# EasyEDA Pro project ProProject_Access Control AC Power Switch_2024-06-07.epro, board V2.0.2 PCB
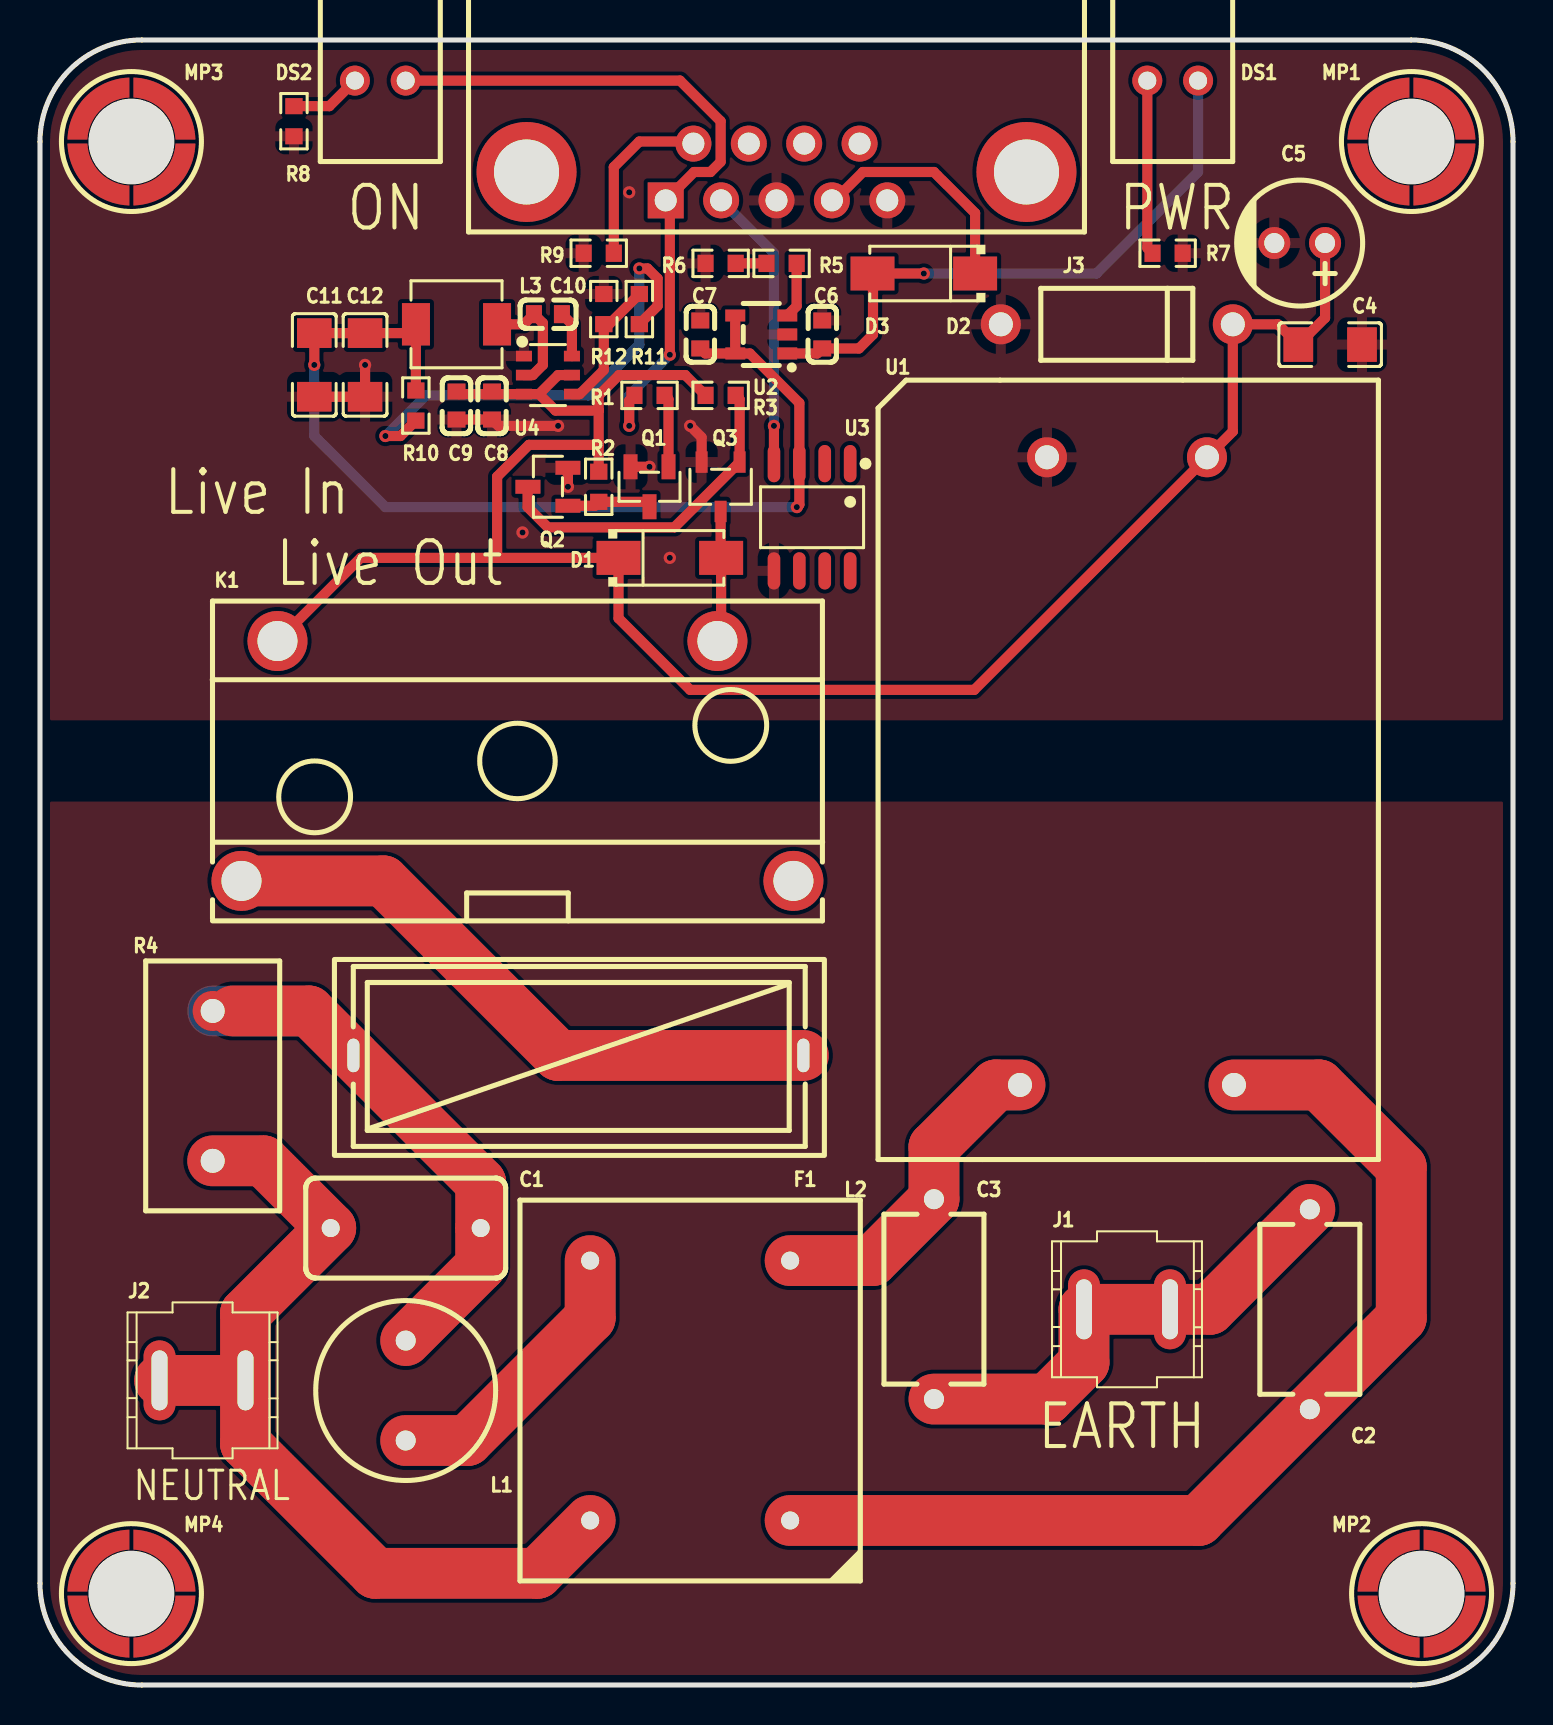
[diagram p5: board, top side]
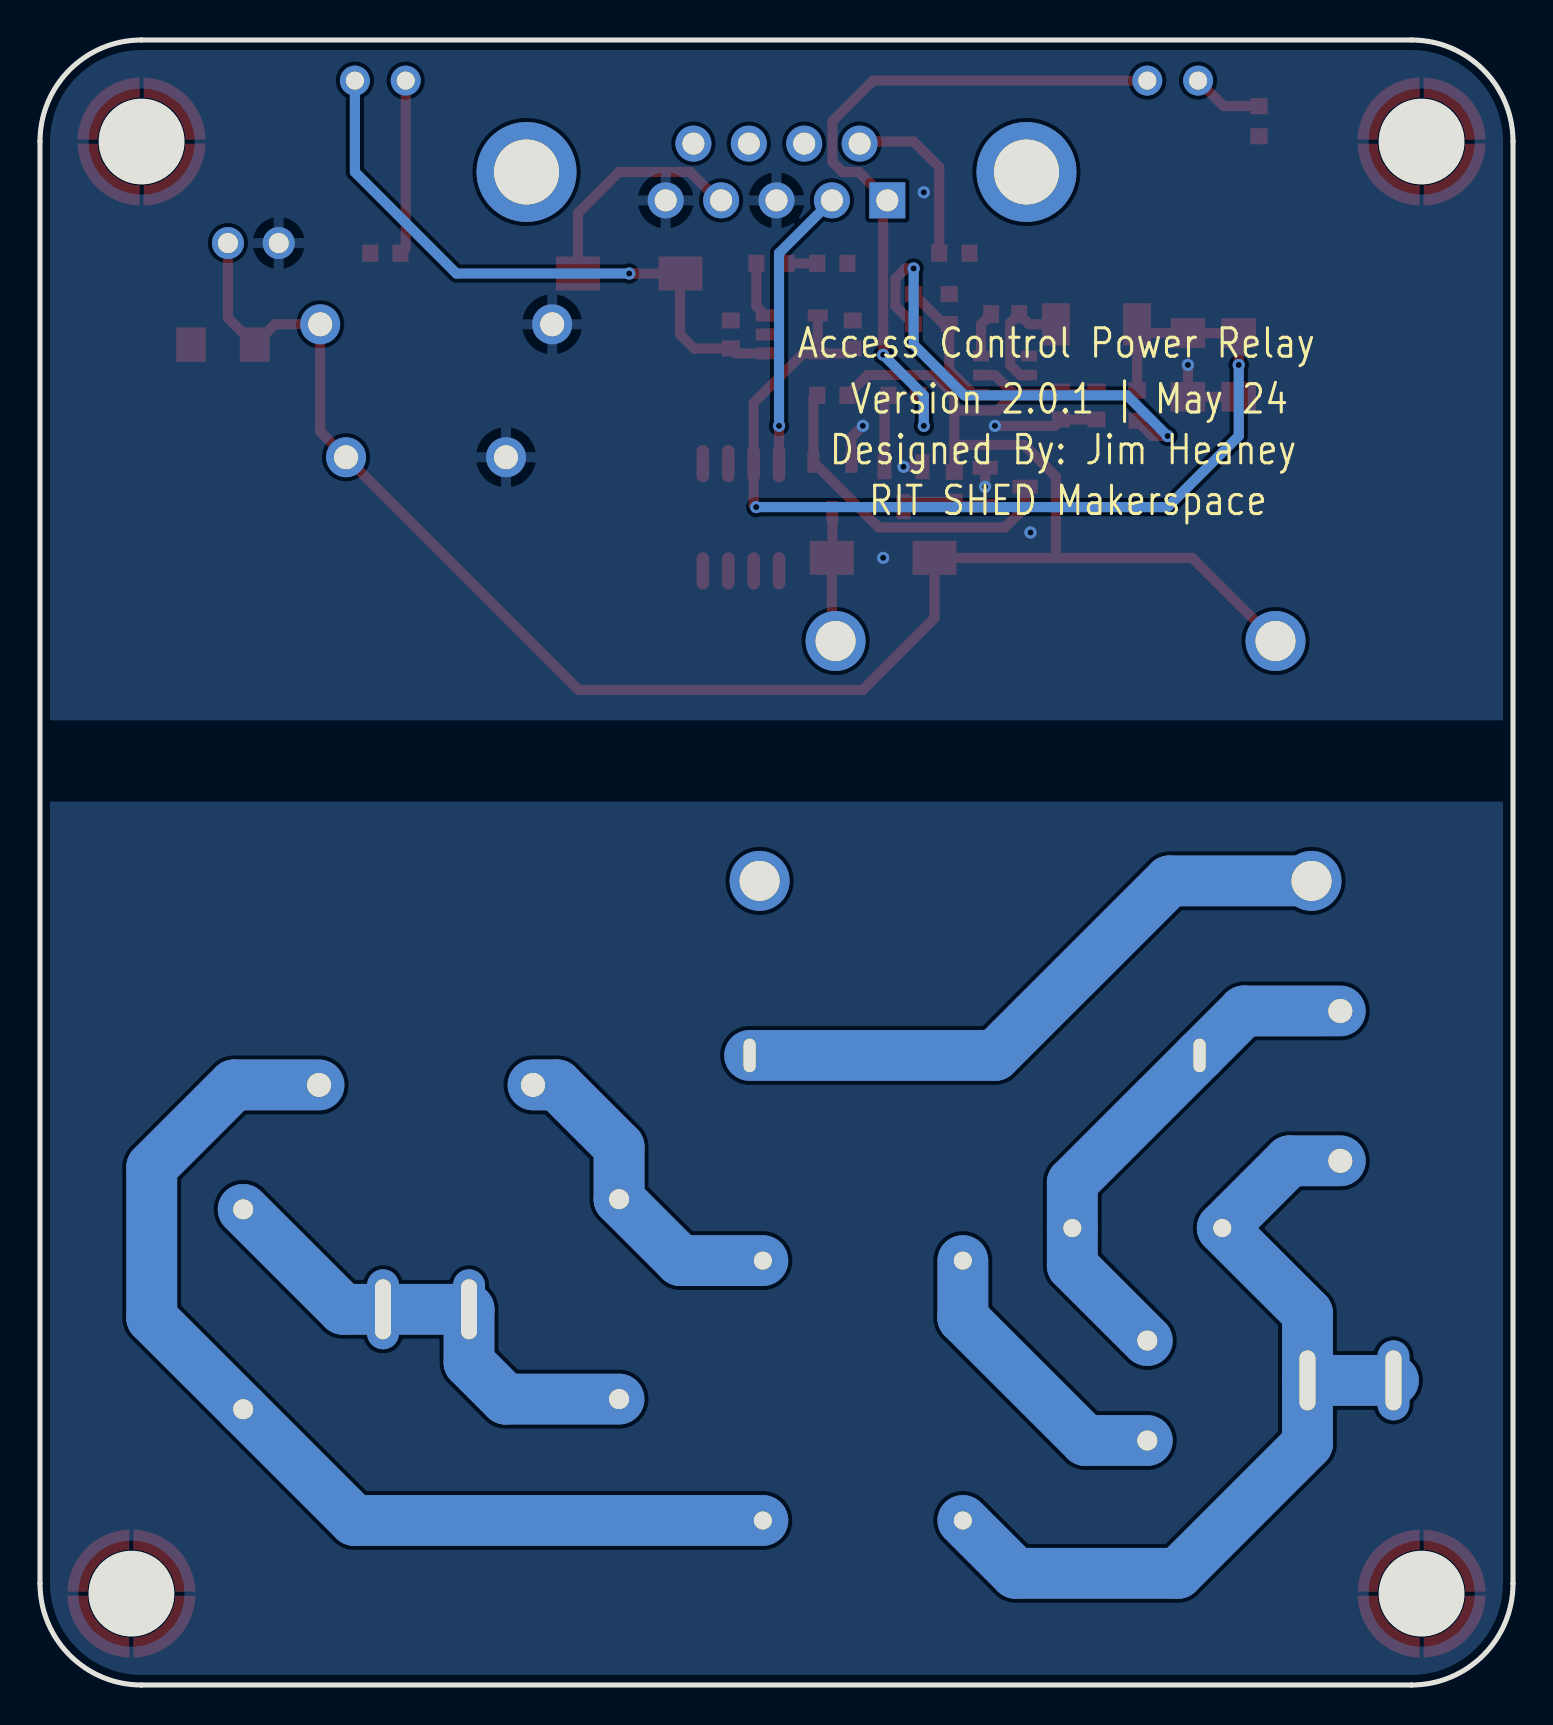
[diagram p6: board, bottom side, seen from below]

Outline 73.66 x 82.3 mm; copper layers: Top Layer, Bottom Layer. Coordinates in mm from the lower left corner of the outline.
Outline path: 0,77.22 0,5.08 arc(1.49,1.49) 5.08,0 68.58,0 arc(72.17,1.49) 73.66,5.08 73.66,77.22 arc(72.17,80.81) 68.58,82.3 5.08,82.3 arc(1.49,80.81) 0,77.22
Stack: Top Layer 0.035mm / Dielectric1 1.51mm FR4 er 4.5 / Bottom Layer 0.035mm

## Design rules (mm)
template: Custom Config
spacing copperThickness1oz (default): track to track 0.102, other pairs 0.152 to 0.3
spacing copperThickness2oz: track to track 0.203, other pairs 0.152 to 0.3
track width copperThickness1oz (default): min 0.127, default 0.254, max 2.54
track width copperThickness2oz: min 0.203, default 0.254, max 2.54
differential pair differentialPair (default): width min 0.127, default 0.254, max 2.54; gap min 0.152, default 0.152
via viaSize (default): diameter min 0.5, default 0.61, max 10; hole min 0.3, default 0.305, max 6.3
net STEAL uses stealcopper
pour e538 uses stealcopper

## Placement (name value [footprint] x y rotation side)
C1  100nF  [CAP-TH_L10.0-W5.0-P7.50-D0.6]  18.29 22.86 180 top
C2  1nF  [CAP-TH_L8.5-W5.0-P10.00-D0.6]  63.5 18.8 270 top
C3  1nF  [CAP-TH_L8.5-W5.0-P10.00-D0.6]  44.7 19.3 270 top
C4  1uF  [C1206]  64.52 67.06 180 top
C5  220uF  [CAP-TH_BD6.3-P2.50-D1.0-FD]  62.99 72.14 180 top
C6  10uF  [C0603]  39.12 67.56 270 top
C7  10uF  [C0603]  33.02 67.56 270 top
C8  10uF  [C0603]  22.61 64.01 90 top
C9  10uF  [C0603]  20.83 64.01 90 top
C10  100nF  [C0603]  25.4 68.58 180 top
C11  47uF  [C1206]  13.72 66.04 90 top
C12  47uF  [C1206]  16.26 66.04 90 top
D1  SS14  [SMA_L4.2-W2.6-LS5.3-RD]  31.5 56.39 0 top
D2  P6KE15A  [DO-15_BD3.1-L6.7-P10.70-D0.9-RD]  53.85 68.07 180 top
D3  SS14  [SMA_L4.2-W2.6-LS5.3-RD]  44.2 70.61 180 top
DS1  MHK1560CRBTD  [LED-TH_MHK1560UGBTD]  56.64 80.26 180 top
DS2  MHK1560UGBTD  [LED-TH_MHK1560UGBTD]  17.02 80.26 180 top
F1  Fuse Holder  [FUSE-TH_L24.5-W9.8-P22.5]  26.92 31.5 180 top
J1  62221-1  [CONN-TH_ESD-62221]  54.36 18.8 0 top
J2  62221-1  [CONN-TH_ESD-62221]  8.13 15.24 0 top
J3  D-SUB-DR-9PCM-CB  [DB9-TH_ID09S33E4GV00LF]  36.83 75.69 180 top
K1  HF102F-12VDC  [RELAY-TH_HF102F-12VDC]  23.88 46.23 0 top
L1  560uH  [IND-TH_BD9.0-P5.00-D0.7]  18.29 14.73 270 top
L2  YDUU10.5-253L0321  [IND-TH_4P-L19.0-W17.0]  32.51 14.73 90 top
L3  4.7uH  [IND-SMD_L4.4-W4.2]  20.83 68.07 0 top
MP1  SMTSOM360BTR  [SMD_BD5.6-D4.1]  68.58 77.22 0 top
MP2  SMTSOM360BTR  [SMD_BD5.6-D4.1]  69.09 4.57 0 top
MP3  SMTSOM360BTR  [SMD_BD5.6-D4.1]  4.57 77.22 0 top
MP4  SMTSOM360BTR  [SMD_BD5.6-D4.1]  4.57 4.57 0 top
Q1  SS8050  [SOT-23-3_L2.9-W1.3-P1.90-LS2.4-BR]  30.48 59.94 90 top
Q2  SS8050  [SOT-23-3_L2.9-W1.3-P1.90-LS2.4-BR]  25.4 59.94 0 top
Q3  AO3400A  [SOT-23-3_L2.9-W1.6-P1.90-LS2.8-BR]  34.04 59.94 90 top
R1  5.1kΩ  [R0603]  30.48 64.52 180 top
R2  5.1kΩ  [R0603]  27.94 59.94 90 top
R3  5.1kΩ  [R0603]  34.04 64.52 180 top
R4  10D471K  [RES-TH_L12.5-W6.7-P7.50-D1.2]  8.64 29.97 270 top
R5  5.1kΩ  [R0603]  37.08 71.12 180 top
R6  5.1kΩ  [R0603]  34.04 71.12 180 top
R7  1kΩ  [R0603]  56.39 71.63 0 top
R8  1kΩ  [R0603]  12.7 78.23 270 top
R9  5.1kΩ  [R0603]  27.94 71.63 0 top
R10  56kΩ  [R0603]  18.8 64.01 90 top
R11  200Ω  [R0603]  29.97 68.83 270 top
R12  10kΩ  [R0603]  28.19 68.83 270 top
U1  TAS10-12-W2  [PWRM-TH_TAS10-XX-W2]  54.36 45.72 90 top
U2  MT9700  [SOT-23-5_L3.0-W1.7-P0.95-LS2.8-BR]  36.07 67.56 0 top
U3  DS18B20Z  [SOP-8_L4.9-W3.9-P1.27-LS6.0-BL]  38.61 58.42 180 top
U4  TPS561208DDCR  [TSOT-23-6_L2.9-W1.6-P0.95-LS2.8-BR]  25.4 65.53 180 top

## Footprints (pads in the part's own frame, mm; a bottom-side part is the same pattern mirrored in y, then rotated)
C0603
  rect 0.8x0.9 smd: 1(-0.7,0) 2(0.7,0)
C1206
  rect 1.485x1.728 smd: 1(-1.593,0) 2(1.593,0)
CAP-TH_BD6.3-P2.50-D1.0-FD
  round 1.6 hole 1: 1(-1.27,0) 2(1.27,0)
CAP-TH_L8.5-W5.0-P10.00-D0.6
  round 1.8 hole 1: 1(-5,0) 2(5,0)
CAP-TH_L10.0-W5.0-P7.50-D0.6
  round 1.524 hole 0.9: 1(-3.75,0) 2(3.75,0)
CONN-TH_ESD-62221
  oval 1.6x4 hole 0.8x3: 1(-2.15,0) 2(2.15,0)
DB9-TH_ID09S33E4GV00LF
  rect 1.8x1.8 hole 1.1: 1(5.54,1.42)
  round 1.8 hole 1.1: 2(2.77,1.42) 3(0,1.42) 4(-2.77,1.42) 5(-5.54,1.42) 6(4.155,-1.42) 7(1.385,-1.42) 8(-1.385,-1.42) 9(-4.155,-1.42)
  round 5 hole 3.25: 10(-12.5,0) 11(12.5,0)
DO-15_BD3.1-L6.7-P10.70-D0.9-RD
  round 2 hole 1.2: 1(-5.8,0) 2(5.8,0)
FUSE-TH_L24.5-W9.8-P22.5
  oval 1x2.4 hole 0.6x1.68: 1(-11.25,0) 2(11.25,0)
IND-SMD_L4.4-W4.2
  rect 1.4x2.12 smd: 1(2.028,0) 2(-2.028,0)
IND-TH_4P-L19.0-W17.0
  round 1.6 hole 0.9: 1(-6.5,-5) 2(6.5,-5) 3(-6.5,5) 4(6.5,5)
IND-TH_BD9.0-P5.00-D0.7
  round 1.8 hole 1: 1(-2.5,0) 2(2.5,0)
LED-TH_MHK1560UGBTD
  round 1.5 hole 0.9: 1(1.27,0) 2(-1.27,0)
PWRM-TH_TAS10-XX-W2
  round 2 hole 1.2: 1(-15.7,-5.35) 2(-15.7,5.35) 4(15.7,4) 6(15.7,-4)
R0603
  rect 0.806x0.864 smd: 1(-0.753,0) 2(0.753,0)
RELAY-TH_HF102F-12VDC
  round 3 hole 2: 1(-12,6) 2(10,6) 3(13.8,-6) 4(-13.8,-6)
RES-TH_L12.5-W6.7-P7.50-D1.2
  round 2 hole 1.2: 1(-3.749,0) 2(3.749,0)
SMA_L4.2-W2.6-LS5.3-RD
  rect 2.2x1.7 smd: 1(-2.566,0) 2(2.566,0)
SMD_BD5.6-D4.1
  custom 3.1x3.1 smd: 1(-2.102,1.65) 2(1.65,2.102) 3(2.102,-1.65) 4(-1.65,-2.102)
SOP-8_L4.9-W3.9-P1.27-LS6.0-BL
  oval 0.63x1.865 smd: 1(-1.905,-2.683) 2(-0.635,-2.683) 3(0.635,-2.683) 4(1.905,-2.683) 5(1.905,2.683) 6(0.635,2.683) 7(-0.635,2.683) 8(-1.905,2.683)
SOT-23-3_L2.9-W1.3-P1.90-LS2.4-BR
  rect 1.25x0.7 smd: 1(1,-0.95) 2(1,0.95) 3(-1,0)
SOT-23-3_L2.9-W1.6-P1.90-LS2.8-BR
  rect 1.07x0.6 smd: 1(1.235,-0.95) 2(1.235,0.95) 3(-1.235,0)
SOT-23-5_L3.0-W1.7-P0.95-LS2.8-BR
  rect 1x0.6 smd: 1(1.3,-0.95) 2(1.3,0) 3(1.3,0.95) 4(-1.3,0.95) 5(-1.3,-0.95)
TSOT-23-6_L2.9-W1.6-P0.95-LS2.8-BR
  rect 0.8x0.532 smd: 1(1.2,-0.95) 2(1.2,0) 3(1.2,0.95) 4(-1.2,0.95) 5(-1.2,0) 6(-1.2,-0.95)

## Nets
As in the schematic.

Pads without a net: J3 7 8 9 10 11; K1 3; MP1 1 2 3 4; MP2 1 2 3 4; MP3 1 2 3 4; MP4 1 2 3 4; U3 1 2 6 7 8

## Via types
v1: diameter 0.61, hole 0.305, Top Layer to Bottom Layer, 16 vias

## Routing (per net, layer and track width the routed paths; a pad name or vN(x,y) marks a point on that pad's centre or on a via; arc(x,y) is an arc through that point)
GND: length 13.3
  Top Layer w0.508: v1(25.91,62.99) 22.92,62.99 C8.1 C9.1 ; Q1.2 v1(30.48,60.94) ; Q2.2 v1(26.4,59.94) ; v1(16.26,66.04) C12.1 C11.1 ; Q3.2 33.09,62.42 v1(32.51,62.99)
  vias: v1(24.13,57.66) v1(29.46,74.68) v1(31.5,56.39)
VIN: length 52.6
  Top Layer w0.508: v1(37.85,58.93) 37.97,59.06 U3.3 37.97,64.14 35.49,66.61 U2.5 ; C7.2 33.27,66.61 U2.5 ; U2.5 U2.4 ; 18.8,68.07 L3.2 ; 18.8,68.07 R10.2 ; 18.8,68.07 18.36,67.63 C12.2 C11.2 v1(13.72,66.04)
  Bottom Layer w0.508: v1(13.72,66.04) 13.72,62.48 17.27,58.93 v1(37.85,58.93)
EARTH: length 48.6
  Top Layer w2.54: C2.1 58.5,18.8 J1.2 J1.1 52.21,16.14 50.37,14.3 C3.2
  Bottom Layer w2.54: C3.2 50.37,14.3 52.21,16.14 J1.1 J1.2 58.5,18.8 C2.1
LIVE_IN: length 63.4
  Top Layer w2.54: F1.1 25.91,31.5 17.18,40.23 K1.4
  Bottom Layer w2.54: F1.1 25.91,31.5 17.18,40.23 K1.4
NEUTRAL: length 90.3
  Top Layer w2.54: J2.2 10.28,18.6 C1.2 11.17,26.22 R4.2 ; J2.2 10.28,12.07 16.76,5.59 24.87,5.59 L2.3 ; J2.2 J2.1
  Bottom Layer w2.54: J2.2 10.28,12.07 16.76,5.59 24.87,5.59 L2.3 ; J2.2 J2.1 ; J2.2 10.28,18.6 C1.2 11.17,26.22 R4.2
NO_SIG: length 36
  Top Layer w0.508: v1(29.46,62.99) 29.46,64.25 R1.2 ; DS2.2 32,80.26 34.04,78.23 34.04,76.2 33.53,75.69 32.71,75.69 J3.1 31.5,74.07 v1(31.5,66.55)
  Bottom Layer w0.508: v1(29.46,62.99) 29.46,64.52 v1(31.5,66.55)
TEMP: length 14.3
  Top Layer w0.508: U3.4 v1(36.7,62.99)
  Bottom Layer w0.508: J3.2 36.7,71.63 v1(36.7,62.99)
VRAW: length 103.4
  Top Layer w0.508: 24.96,64.58 25.79,63.75 27.93,63.75 27.94,63.76 ; 24.96,64.58 U4.3 20.95,64.58 C9.2 ; 24.96,64.58 25.91,65.53 U4.5 ; 27.94,63.76 27.94,62.04 ; 27.94,63.76 27.94,64.52 28.96,65.53 32.27,65.53 R3.2 ; 27.94,62.04 24.45,62.04 22.86,60.45 22.86,56.39 ; 27.94,62.04 R2.2 ; 22.86,56.39 D1.1 28.93,53.37 32.51,49.78 46.72,49.78 U1.6 59.65,62.71 D2.1 61.91,68.07 C4.2 64.26,68.39 C5.1 ; 22.86,56.39 16.04,56.39 K1.1
VSW: length 30.7
  Top Layer w0.508: v1(44.2,70.61) D3.2 41.66,70.59 41.66,67.56 40.96,66.86 C6.2 38.87,66.61 U2.1
  Bottom Layer w0.508: v1(44.2,70.61) 52.83,70.61 57.91,75.69 DS1.2
$1N597: length 51.8
  Top Layer w2.54: L1.1 22.04,20.98 C1.1 22.04,25.13 F1.2 13.45,33.72 9.65,33.72
  Bottom Layer w2.54: R4.1 13.45,33.72 F1.2 22.04,25.13 C1.1 22.04,20.98 L1.1
$1N1636: length 6.6
  Top Layer w0.508: K1.2 34.06,52.41 D1.2 34.04,56.41 Q3.3
$1N1642: length 4.3
  Top Layer w0.508: Q2.1 27.74,58.99 R2.1 30.23,59.19 Q1.3
$1N1954: length 29.3
  Top Layer w2.54: L2.4 27.51,18.37 21.38,12.23 L1.2
  Bottom Layer w2.54: L1.2 21.38,12.23 27.51,18.37 L2.4
$1N1959: length 33.3
  Top Layer w2.54: U1.2 47.8,30.02 44.7,26.92 C3.1 41.63,21.23 L2.2
  Bottom Layer w2.54: U1.2 47.8,30.02 44.7,26.92 C3.1 41.63,21.23 L2.2
$1N1966: length 104.7
  Top Layer w2.54: U1.1 63.96,30.02 68.07,25.91 68.07,18.37 C2.2 57.94,8.23 L2.1
  Bottom Layer w2.54: L2.1 57.94,8.23 C2.2 68.07,18.37 68.07,25.91 63.96,30.02 U1.1
$1N3143: length 8.9
  Top Layer w0.508: J3.6 32.57,77.22 29.97,77.22 28.69,75.94 R9.2
$1N3234: length 16.8
  Top Layer w0.508: Q2.3 24.38,59.93 24.38,58.93 25.4,57.91 31.72,57.91 Q3.1 34.99,64.32 R3.1
$1N7143: length 2.8
  Top Layer w0.508: U2.3 37.84,68.98 R5.1
$1N7225: length 1.5
  Top Layer w0.508: R5.2 R6.1
$1N7266: length 3.6
  Top Layer w0.508: DS2.1 14.47,78.99 R8.1
$1N7306: length 8.7
  Top Layer w0.508: DS1.1 55.37,71.89 R7.1
$1N7956: length 5.9
  Top Layer w0.508: L3.1 24.19,68.07 C10.2 25.15,68.13 25.15,66.04 24.64,65.53 U4.2
$1N8144: length 2.3
  Top Layer w0.508: U4.6 26.6,68.08 C10.1
$1N8366: length 24
  Top Layer w0.508: v1(17.27,62.48) 18.03,62.48 R10.1 ; R11.2 30.89,68.99 30.89,70.36 30.38,70.87 v1(29.97,70.87)
  Bottom Layer w0.508: v1(17.27,62.48) 19.3,64.52 27.43,64.52 29.97,67.06 v1(29.97,70.87)
$1N8390: length 6.8
  Top Layer w0.508: U4.4 26.99,64.58 28.19,65.79 R12.2 28.47,68.08 R11.1
$1N8924: length 11.6
  Top Layer w0.508: J3.4 39.73,74.27 41.15,75.69 44.7,75.69 46.76,73.63 D3.1
$1N10465: length 3.7
  Top Layer w0.508: Q1.1 31.43,64.32 R1.1

## Copper pours and planes (outline as drawn; the poured copper is in the pictures)
GND on Top Layer: -1.52,97.03 74.17,97.03 74.17,48.26 -1.52,48.26
GND on Bottom Layer: -15.24,83.31 88.39,83.31 88.39,48.26 -15.24,48.26
STEAL on Top Layer: -30.99,44.2 75.69,44.2 75.69,-6.1 -30.99,-6.1
STEAL on Bottom Layer: -5.08,44.2 91.44,44.2 91.44,-9.14 -5.08,-9.14

## Text on the board
Bottom Silkscreen Layer: RIT SHED Makerspace | Version 2.0.1 | May 24 | Designed By: Jim Heaney | Access Control Power Relay
Top Silkscreen Layer: NEUTRAL | Live In | Live Out | ON | EARTH | PWR
